# Altium schematic sheet expansion.SchDoc: Zillion - Z80 Single Board Computer
size A4; Author: Francesco Sacco; Revision: 0; ProjectName: Zillion - Z80 Single Board Computer
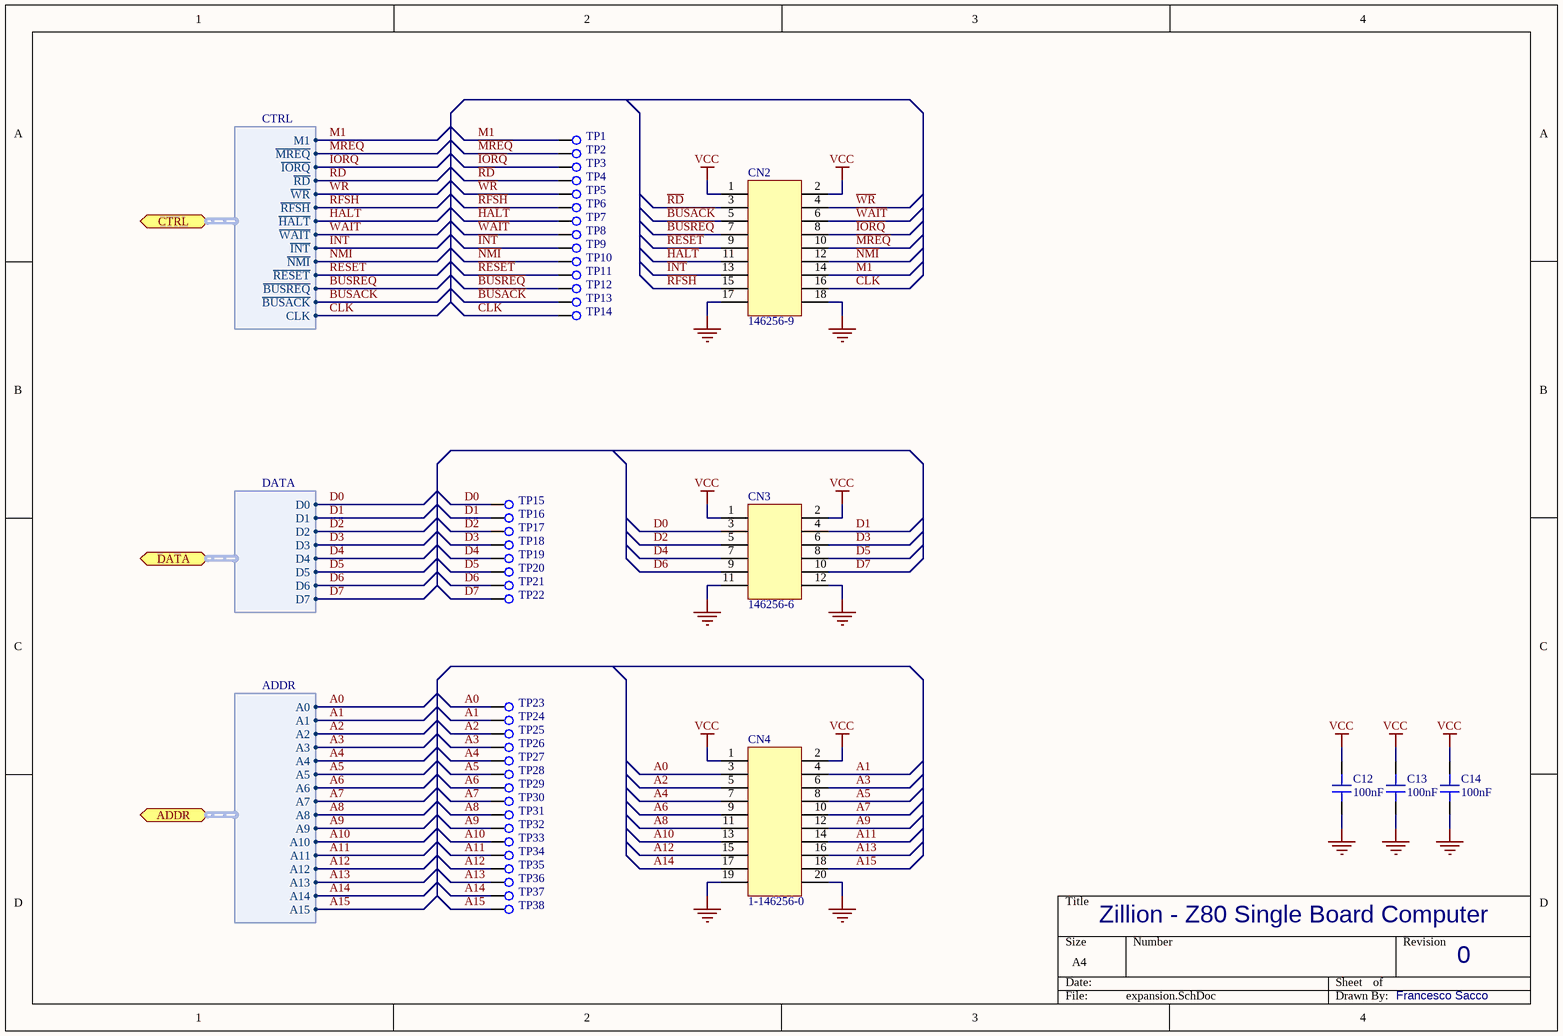
[diagram p0: expansion.SchDoc]

## Parts
C12  100nF  [DiskCapacitor]
C13  100nF  [DiskCapacitor]
C14  100nF  [DiskCapacitor]
CN2  146256-9  [146256-9]
CN3  146256-6  [146256-6]
CN4  1-146256-0  [1-146256-0]
TP1  Test Point  [Test Point Trace]  (value not drawn)
TP2  Test Point  [Test Point Trace]  (value not drawn)
TP3  Test Point  [Test Point Trace]  (value not drawn)
TP4  Test Point  [Test Point Trace]  (value not drawn)
TP5  Test Point  [Test Point Trace]  (value not drawn)
TP6  Test Point  [Test Point Trace]  (value not drawn)
TP7  Test Point  [Test Point Trace]  (value not drawn)
TP8  Test Point  [Test Point Trace]  (value not drawn)
TP9  Test Point  [Test Point Trace]  (value not drawn)
TP10  Test Point  [Test Point Trace]  (value not drawn)
TP11  Test Point  [Test Point Trace]  (value not drawn)
TP12  Test Point  [Test Point Trace]  (value not drawn)
TP13  Test Point  [Test Point Trace]  (value not drawn)
TP14  Test Point  [Test Point Trace]  (value not drawn)
TP15  Test Point  [Test Point Trace]  (value not drawn)
TP16  Test Point  [Test Point Trace]  (value not drawn)
TP17  Test Point  [Test Point Trace]  (value not drawn)
TP18  Test Point  [Test Point Trace]  (value not drawn)
TP19  Test Point  [Test Point Trace]  (value not drawn)
TP20  Test Point  [Test Point Trace]  (value not drawn)
TP21  Test Point  [Test Point Trace]  (value not drawn)
TP22  Test Point  [Test Point Trace]  (value not drawn)
TP23  Test Point  [Test Point Trace]  (value not drawn)
TP24  Test Point  [Test Point Trace]  (value not drawn)
TP25  Test Point  [Test Point Trace]  (value not drawn)
TP26  Test Point  [Test Point Trace]  (value not drawn)
TP27  Test Point  [Test Point Trace]  (value not drawn)
TP28  Test Point  [Test Point Trace]  (value not drawn)
TP29  Test Point  [Test Point Trace]  (value not drawn)
TP30  Test Point  [Test Point Trace]  (value not drawn)
TP31  Test Point  [Test Point Trace]  (value not drawn)
TP32  Test Point  [Test Point Trace]  (value not drawn)
TP33  Test Point  [Test Point Trace]  (value not drawn)
TP34  Test Point  [Test Point Trace]  (value not drawn)
TP35  Test Point  [Test Point Trace]  (value not drawn)
TP36  Test Point  [Test Point Trace]  (value not drawn)
TP37  Test Point  [Test Point Trace]  (value not drawn)
TP38  Test Point  [Test Point Trace]  (value not drawn)

## Ports
ADDR (harness ADDR), CTRL (harness CTRL), DATA (harness DATA)

## Harnesses
CTRL: M1, ~{MREQ}, ~{IORQ}, ~{RD}, ~{WR}, ~{RFSH}, ~{HALT}, ~{WAIT}, ~{INT}, ~{NMI}, ~{RESET}, ~{BUSREQ}, ~{BUSACK}, CLK
ADDR: A0, A1, A2, A3, A4, A5, A6, A7, A8, A9, A10, A11, A12, A13, A14, A15
DATA: D0, D1, D2, D3, D4, D5, D6, D7

## Nets
GND: C12.1 C13.1 C14.1 CN2.17 CN2.18 CN3.11 CN3.12 CN4.19 CN4.20
VCC: C12.2 C13.2 C14.2 CN2.1 CN2.2 CN3.1 CN3.2 CN4.1 CN4.2
A0: CN4.3 TP23.1 ; port ADDR.A0
A1: CN4.4 TP24.1 ; port ADDR.A1
A2: CN4.5 TP25.1 ; port ADDR.A2
A3: CN4.6 TP26.1 ; port ADDR.A3
A4: CN4.7 TP27.1 ; port ADDR.A4
A5: CN4.8 TP28.1 ; port ADDR.A5
A6: CN4.9 TP29.1 ; port ADDR.A6
A7: CN4.10 TP30.1 ; port ADDR.A7
A8: CN4.11 TP31.1 ; port ADDR.A8
A9: CN4.12 TP32.1 ; port ADDR.A9
A10: CN4.13 TP33.1 ; port ADDR.A10
A11: CN4.14 TP34.1 ; port ADDR.A11
A12: CN4.15 TP35.1 ; port ADDR.A12
A13: CN4.16 TP36.1 ; port ADDR.A13
A14: CN4.17 TP37.1 ; port ADDR.A14
A15: CN4.18 TP38.1 ; port ADDR.A15
~{BUSACK}: CN2.5 TP13.1 ; port CTRL.~{BUSACK}
~{BUSREQ}: CN2.7 TP12.1 ; port CTRL.~{BUSREQ}
CLK: CN2.16 TP14.1 ; port CTRL.CLK
D0: CN3.3 TP15.1 ; port DATA.D0
D1: CN3.4 TP16.1 ; port DATA.D1
D2: CN3.5 TP17.1 ; port DATA.D2
D3: CN3.6 TP18.1 ; port DATA.D3
D4: CN3.7 TP19.1 ; port DATA.D4
D5: CN3.8 TP20.1 ; port DATA.D5
D6: CN3.9 TP21.1 ; port DATA.D6
D7: CN3.10 TP22.1 ; port DATA.D7
~{HALT}: CN2.11 TP7.1 ; port CTRL.~{HALT}
~{INT}: CN2.13 TP9.1 ; port CTRL.~{INT}
~{IORQ}: CN2.8 TP3.1 ; port CTRL.~{IORQ}
M1: CN2.14 TP1.1 ; port CTRL.M1
~{MREQ}: CN2.10 TP2.1 ; port CTRL.~{MREQ}
~{NMI}: CN2.12 TP10.1 ; port CTRL.~{NMI}
~{RD}: CN2.3 TP4.1 ; port CTRL.~{RD}
~{RESET}: CN2.9 TP11.1 ; port CTRL.~{RESET}
~{RFSH}: CN2.15 TP6.1 ; port CTRL.~{RFSH}
~{WAIT}: CN2.6 TP8.1 ; port CTRL.~{WAIT}
~{WR}: CN2.4 TP5.1 ; port CTRL.~{WR}

## Library data of the parts
C12-C14 = Capacitor
CN2 = 146256-9: CONN Header Breakaway
CN3 = 146256-6: CONN Header Breakaway
CN4 = 1-146256-0: CONN Header Breakaway